# Altium schematic sheet USB_Charger.SchDoc
size A4
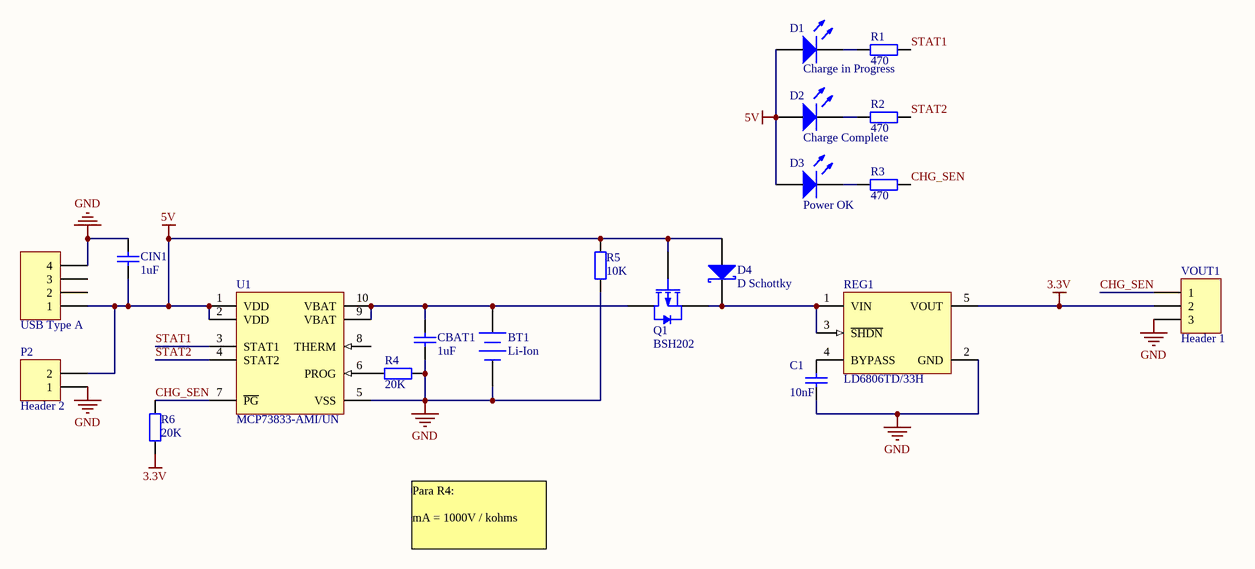
[diagram p0: USB_Charger.SchDoc]

## Parts
BT1  Li-Ion  [BAT-2]
C1  value 10nF  [1608[0603]]  (hidden comment: Cap)
CBAT1  value 1uF  [1608[0603]]  (hidden comment: Cap)
CIN1  value 1uF  [1608[0603]]  (hidden comment: Cap)
D1  Charge in Progress  [2013[0805]]
D2  Charge Complete  [2013[0805]]
D3  Power OK  [2013[0805]]
D4  D Schottky  [SOD123/X.85]
P1  USB Type A  [USBA_SMD]
P2  Header 2  [HDR1X2]
Q1  BSH202  [SOT23_M]
R1  value 470  [1608[0603]]  (hidden comment: Res2)
R2  value 470  [1608[0603]]  (hidden comment: Res2)
R3  value 470  [1608[0603]]  (hidden comment: Res2)
R4  value 20K  [1608[0603]]  (hidden comment: Res2)
R5  value 10K  [1608[0603]]  (hidden comment: Res2)
R6  value 20K  [1608[0603]]  (hidden comment: Res2)
REG1  LD6806TD/33H  [DBV005_N]
U1  MCP73833-AMI/UN  [MSOP-UN10_N]
VOUT1  Header 1  [HDR1X3H]

## Nets
3.3V: R6.2 REG1.5(VOUT) VOUT1.2
5V: CIN1.2 D1.1 D2.1 D3.1 D4.1(A) P1.1 P2.2 Q1.1(G) R5.1 U1.1(VDD) U1.2(VDD)
GND: BT1.2(-) C1.1 CBAT1.2 CIN1.1 P1.4 P2.1 R4.1 R5.2 REG1.2(GND) U1.5(VSS) VOUT1.3
CHG_SEN: R3.2 R6.1 U1.7(~{PG}) VOUT1.1
STAT1: R1.2 U1.3(STAT1)
STAT2: R2.2 U1.4(STAT2)
NetBT1_1: BT1.1(+) CBAT1.1 Q1.3(D) U1.9(VBAT) U1.10(VBAT)
NetC1_2: C1.2 REG1.4(BYPASS)
NetD1_2: D1.2 R1.1
NetD2_2: D2.2 R2.1
NetD3_2: D3.2 R3.1
NetD4_2: D4.2(K) Q1.2(S) REG1.1(VIN) REG1.3(~{SHDN})
NetR4_2: R4.2 U1.6(PROG)

Not connected (* = marked no-connect by the designer): P1 2 3; U1 8(THERM)

## Notes on the sheet
- Para R4:
  mA = 1000V / kohms

## Library data of the parts
BT1 = Battery: Multicell Battery; Published: 24-Mar-1999; LatestRevisionDate: 17-Jul-2002; LatestRevisionNote: Re-released for DXP Platform.; PackageReference: BAT-2; Publisher: Altium Limited
C1 CBAT1 CIN1 = Cap: Capacitor; Published: 8-Jun-2000; LatestRevisionDate: 17-Jul-2002; LatestRevisionNote: Re-released for DXP Platform.; PackageReference: RAD-0.3; Publisher: Altium Limited
D1-D3 = LED SMD (0603)
D4 = D Schottky: Schottky Diode; Published: 8-Jun-2000; LatestRevisionDate: 17-Jul-2002; LatestRevisionNote: Re-released for DXP Platform.; PackageReference: SMB; Publisher: Altium Limited; Code_JEDEC: DO-214-AA
P1 = Header 4: Header, 4-Pin; LatestRevisionDate: 17-Jul-2002; LatestRevisionNote: Re-released for DXP Platform.; Publisher: Altium Limited
P2 = Header 2: Header, 2-Pin; LatestRevisionDate: 17-Jul-2002; LatestRevisionNote: Re-released for DXP Platform.; Publisher: Altium Limited
Q1 = BSH202: P-channel Enhancement Mode MOSFET; Published: 17-Sep-2003; LatestRevisionDate: 12-Dec-2006; LatestRevisionNote: IPC-7351 Footprint Added.; DatasheetVersion: Aug-1998; PackageVersion: May-1999; PackageReference: SOT23; Publisher: Altium Limited; PackageDescription: 3-Pin SOT-23 Package 0.95 mm Pitch, 2.3 mm Lead Span; ComponentLink1Description: Manufacturer Link; ComponentLink1URL: http://www.semiconductors.philips.com/; ComponentLink2Description: Datasheet; ComponentLink2URL: http://www.semiconductors.philips.com/acrobat/datasheets/BSH202_3.pdf
R1-R6 = Res2: Resistor; Published: 8-Jun-2000; LatestRevisionDate: 17-Jul-2002; LatestRevisionNote: Re-released for DXP Platform.; PackageReference: AXIAL-0.4; Publisher: Altium Limited
REG1 = TC1014-1.8VCT713: 50 mA, 100 mA and 150 mA CMOS LDOs with Active-Low Shutdown and Reference Bypass, 5-Pin SOT-23, Extended Temperature, Tape and Reel; FirstPublished: 29-Jan-2009; DatasheetVersion: revE, Feb-2007; PackageVersion: revBB, Aug-2009; PackageReference: SOT-23-CT5; Publisher: Altium Limited; PackageDescription: 5-Lead Plastic Small Outline Transistor (CT) [SOT-23]; Supplier 1: Digi-Key; Supplier Part Number 1: TC10141.8VCT713TR-ND; Supplier 2: Digi-Key; Supplier Part Number 2: TC10141.8VCT713CT-ND; Supplier 3: Digi-Key; Supplier Part Number 3: TC10141.8VCT713DKR-ND; Supplier 4: Farnell; Supplier Part Number 4: 1331500; Supplier 5: Newark; Supplier Part Number 5: 27C9045; Code_IPC: SOT23-5; ComponentLink1Description: Datasheet; ComponentLink1URL: http://ww1.microchip.com/downloads/en/DeviceDoc/21335e.pdf; ComponentLink2Description: Packaging Specification; ComponentLink2URL: http://www.microchip.com/stellent/groups/techpub_sg/documents/packagingspec/en012702.pdf; ComponentLink3Description: Microchip.com Home; ComponentLink3URL: http://www.microchip.com/
U1 = MCP73833-AMI/UN: Stand-Alone Linear Li-Ion/Li-Polymer Charge Management Controller with Power-Good Output, 4.2V, 10-Pin MSOP, Industrial Temperature; FirstPublished: 29-Jan-2009; LatestRevisionDate: 27-Nov-2009; LatestRevisionNote: Updated to datasheet revision B, May-2009; DatasheetVersion: revB, May-2009; PackageVersion: revBB, Aug-2009; PackageReference: MSOP-UN10; Publisher: Altium Limited; PackageDescription: 10-Lead Plastic Micro Small Outline Package (UN) [MSOP]; Supplier 1: Digi-Key; Supplier Part Number 1: MCP73833-AMI/UN-ND; Supplier 2: Farnell; Supplier Part Number 2: 1332160; Supplier 3: Newark; Supplier Part Number 3: 88K5664; ComponentLink1Description: Datasheet; ComponentLink1URL: http://ww1.microchip.com/downloads/en/DeviceDoc/22005b.pdf; ComponentLink2Description: Packaging Specification; ComponentLink2URL: http://www.microchip.com/stellent/groups/techpub_sg/documents/packagingspec/en012702.pdf; ComponentLink3Description: Microchip.com Home; ComponentLink3URL: http://www.microchip.com/
VOUT1 = Header 3: Header, 3-Pin; LatestRevisionDate: 17-Jul-2002; LatestRevisionNote: Re-released for DXP Platform.; Publisher: Altium Limited